# EAGLE schematic lcd-schematics (EAGLE 6.6.0)
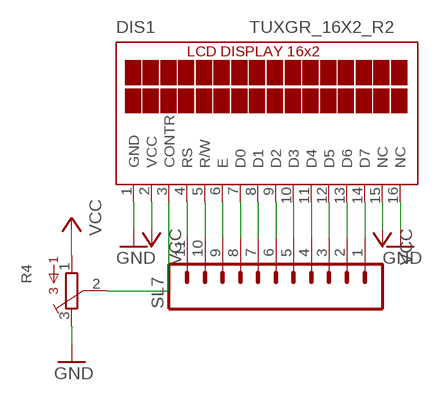
[diagram p0: schematic, sheet 1]

## Parts
DIS1  TUXGR_16X2_R2  [TUXGR_16X2_R2]
R4  3362P  [3362P]
SL7  M11  [11P]

## Nets
GND: DIS1.1(GND) DIS1.16(NC) R4.3
N$53: DIS1.14(D7) SL7.1
N$54: DIS1.13(D6) SL7.2
N$55: DIS1.12(D5) SL7.3
N$56: DIS1.11(D4) SL7.4
N$57: DIS1.10(D3) SL7.5
N$58: DIS1.9(D2) SL7.6
N$59: DIS1.8(D1) SL7.7
N$60: DIS1.7(D0) SL7.8
N$61: DIS1.6(E) SL7.9
N$62: DIS1.5(R/W) SL7.10
N$63: DIS1.4(RS) SL7.11
N$64: R4.1
N$127: DIS1.3(CONTR) R4.2
VCC: DIS1.2(VCC) DIS1.15(NC)

## Library data of the parts
DIS1 = display-lcd:TUXGR_16X2_R2: Tuxgraphics LCD display 16x2 characters reflective, without background light Source: tuxgr_12x2_r2.pdf; OC_FARNELL: unknown; OC_NEWARK: unknown
R4 = bourns:3362: 3362 Series 1/4" Square Trimmer
SL7 = con-amp-quick:M11: AMP QUICK CONNECTOR; OC_FARNELL: unknown; OC_NEWARK: unknown